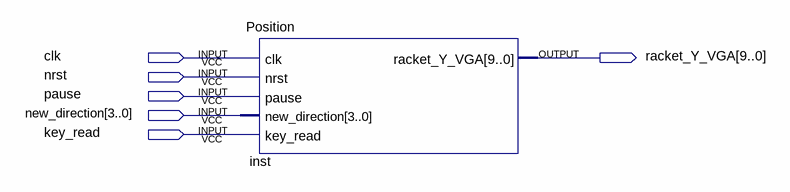
[diagram p0: schematic sheet]
// Quartus schematic Position_Test.bdf as structural Verilog: 1 symbols, 6 pins
module Position_Test (
  input  clk,
  input  nrst,
  input  pause,
  input  [3:0] new_direction,
  input  key_read,
  output [9:0] racket_Y_VGA
);

  Position inst (
    .clk(clk), .nrst(nrst), .pause(pause), .new_direction(new_direction), .key_read(key_read),
    .racket_Y_VGA(racket_Y_VGA));
endmodule
